# EAGLE board Main_Board_Rev_A1 (EAGLE 7.7.0)
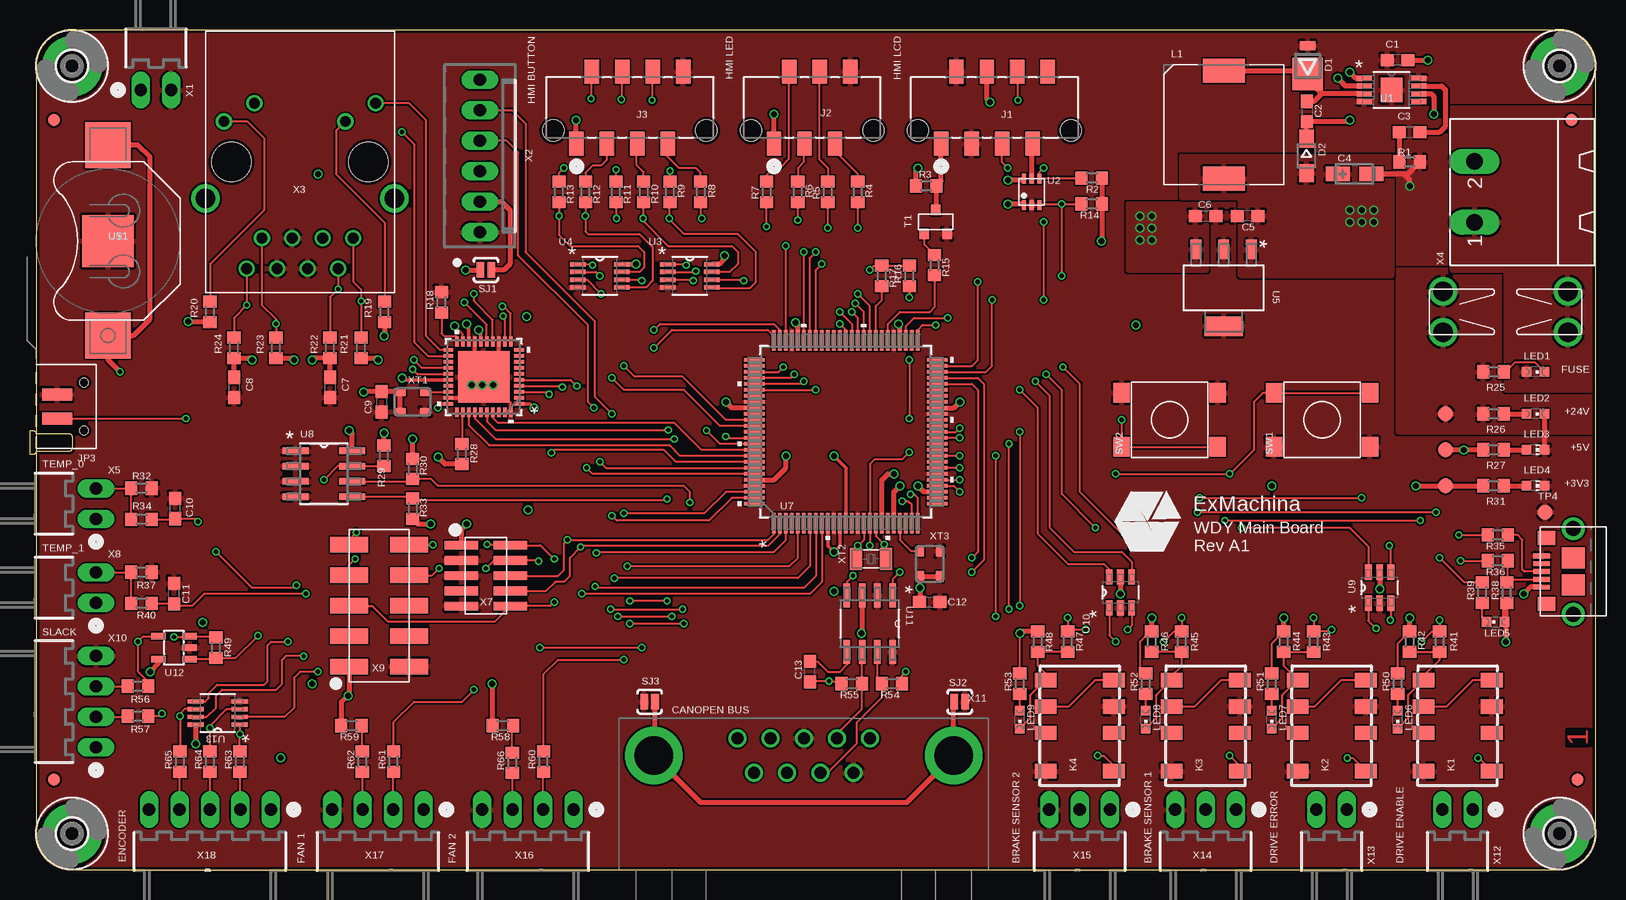
[diagram p5: board, top side]
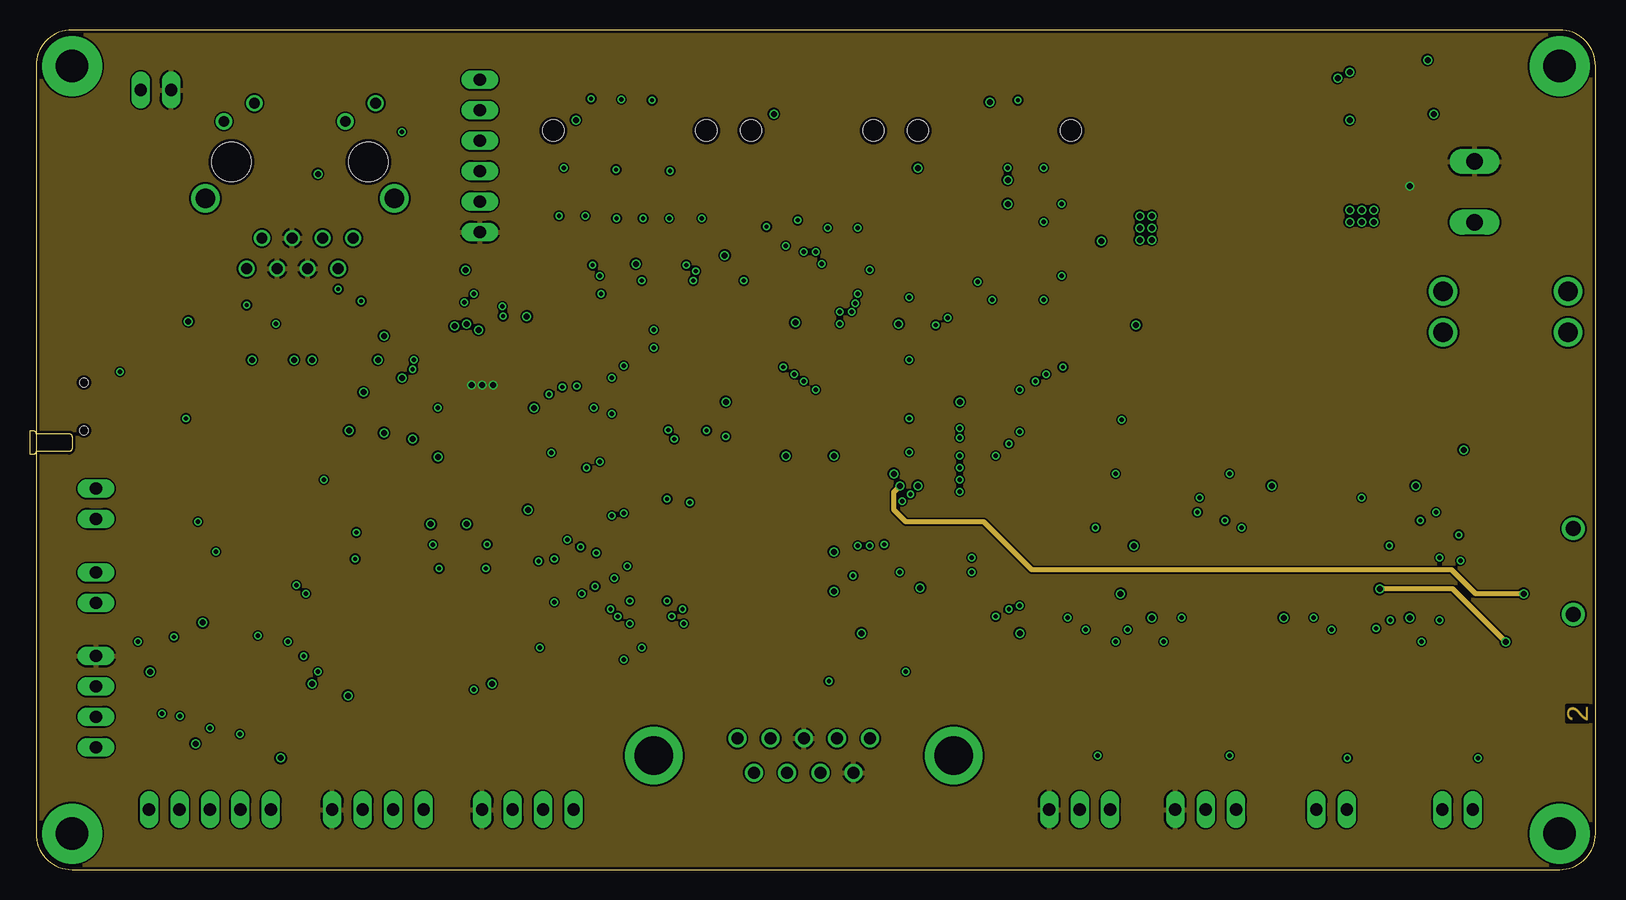
[diagram p6: board, inner layer Route2]
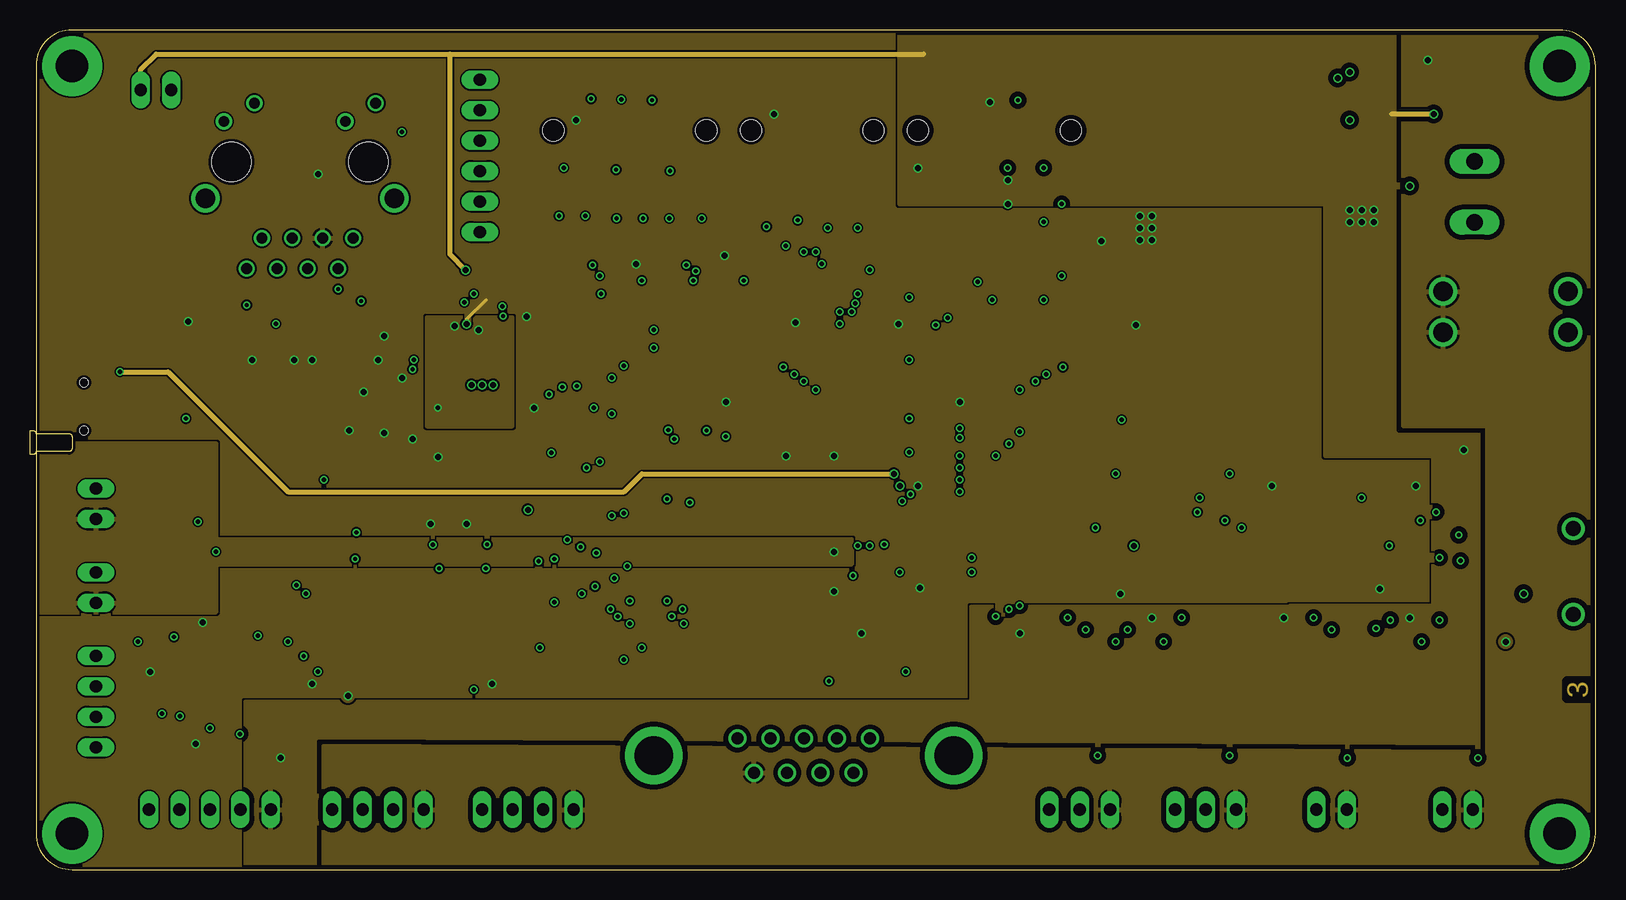
[diagram p7: board, inner layer Route15]
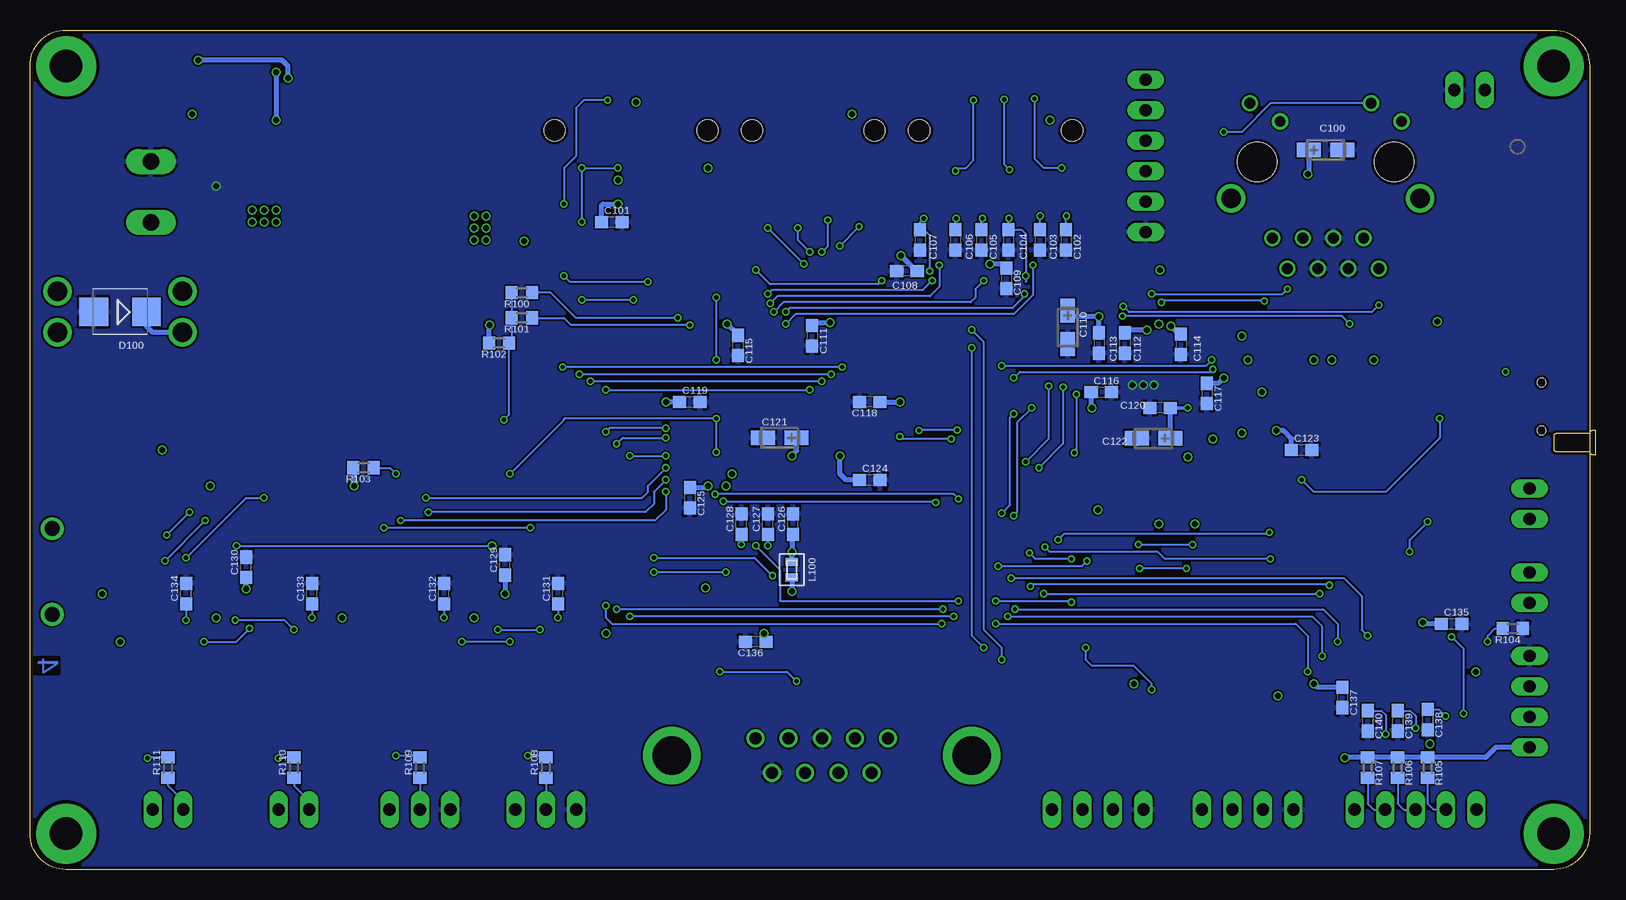
[diagram p8: board, bottom side, seen from below]

Size 130 x 70 mm. Coordinates in mm from the lower left corner, seen from the top.
Outline: 0,67 0,3 arc90 3,0 127,0 arc90 130,3 130,67 arc90 127,70 3,70 arc90 0,67
Copper layers (1+2*15+16): Top 0.018mm / dielectric 0.36mm / Route2 0.035mm / dielectric 0.71mm / Route15 0.035mm / dielectric 0.2mm / Bottom 0.018mm
Design rules "eC_4Layer_PClass6_BaseCopperO18-I35_eCDefault *": minimum track width 0.15mm, minimum drill 0.35mm, track to track 0.15mm, track to pad 0.15mm, pad to pad 0.15mm, via to via 0.15mm, smd to smd 0mil, copper to edge 0.25mm, drill to drill 0.35mm, minimum pad ring 0.175mm, minimum via ring 0.125mm, stop-mask expansion 0mil, vias tented up to drill 0.5mm, thermal gap 0.2mm
Net classes: 1 signal: width 0.178 mm, drill 0.35 mm; 2 supply: width 0.008 mm, drill 0.5 mm

## Footprints (pad centres in the part's own frame; a part is rotated, then mirrored left to right if it is on the bottom)
C0603 = smd 1.1 x 1: 1 -0.85,0; 2 0.85,0
CT3216 = smd 2 x 1.2: + -1.4,0; - 1.4,0
DO216AA = smd 0.76 x 1.27: A 0.7,0 | smd 2.67 x 2.574: C -1.665,0
SOD323-W = smd 1.5 x 1.2: A 1.45,0; C -1.45,0
SMB = smd 2.4 x 2.4: A 2.2,0; C -2.2,0
3557-LITTLE = drill 1.6: 1 -5.207,-1.702; 2 -5.207,1.702; 3 5.207,-1.702; 4 5.207,1.702
MOLEX_90814-0208 = smd 1.194 x 2.007: 1 -4.445,-3.175; 2 -3.175,2.819; 3 -1.905,-3.175; 4 -0.635,2.819; 5 0.635,-3.175; 6 1.905,2.819; 7 3.175,-3.175; 8 4.445,2.819 | hole 1.753: -6.375,-2.083; 6.375,-2.083
MOLEX_90814-0206 = smd 1.194 x 2.007: 1 -3.175,-3.175; 2 -1.905,2.819; 3 -0.635,-3.175; 4 0.635,2.819; 5 1.905,-3.175; 6 3.175,2.819 | hole 1.753: -5.105,-2.083; 5.105,-2.083
FIDUCIAL-1X2 = smd 1 x 1: 1 0,0
BC-2-P = smd 1 x 2.5: 1 -1,-0.75; 2 1,-0.75 | hole 0.7: -2,-3; 2,-3
G6K-2G-Y = smd 1.2 x 1.8: 1 -3.8,-2.85; 2 -0.6,-2.85; 3 1.6,-2.85; 4 3.8,-2.85; 5 3.8,2.85; 6 1.6,2.85; 7 -0.6,2.85; 8 -3.8,2.85
WE-PD_1030/1050 = smd 2 x 3.5: 1 -4.5,0; 2 4.5,0
0603 = smd 0.64 x 1.02: P$1 -0.64,0; P$2 0.64,0
CHIPLED_0603 = smd 0.8 x 0.8: A 0,-0.75; C 0,0.75
CHIP-LED0603 = smd 0.8 x 0.8: A 0,-0.75; C 0,0.75
P2.5 = drill 2.7 pad 5: 1 0,0
R0603 = smd 1 x 1.1: 1 -0.85,0; 2 0.85,0
SJ_2S-NO = smd 0.635 x 1.27: 1 -0.45,0; 2 0.45,0
B3FS = smd 1.4 x 1.6: 1 4,-2.25; 2 -4,-2.25; 3 4,2.25; 4 -4,2.25
SOT−23 = smd 0.787 x 0.889: 1 0.94,1.003; 2 -0.94,1.003; 3 0,-1.003
B1,27 = smd 1.27 x 1.27: TP 0,0
SOP65P490X110-9N = smd 1.245 x 0.432: 1 -2.261,0.965; 2 -2.261,0.33; 3 -2.261,-0.33; 4 -2.261,-0.965; 5 2.261,-0.965; 6 2.261,-0.33; 7 2.261,0.33; 8 2.261,0.965 | smd 1.829 x 2.057: 9 0,0
SC-70-DCK = smd 0.35 x 0.85: 1 -0.65,-1.1; 2 0,-1.1; 3 0.65,-1.1; 4 0.65,1.1; 5 0,1.1; 6 -0.65,1.1
SOP65P400X130-8N = smd 1.321 x 0.356: 1 -1.829,0.965; 2 -1.829,0.33; 3 -1.829,-0.33; 4 -1.829,-0.965; 5 1.829,-0.965; 6 1.829,-0.33; 7 1.829,0.33; 8 1.829,0.965
SOT230P700X180-4N = smd 1.626 x 0.889: 1 -3.2,2.311; 2 -3.2,0; 3 -3.2,-2.311 | smd 1.626 x 3.175: 4 3.2,0
SQA40B = smd 0.813 x 0.305: 1 -2.946,2.25; 2 -2.946,1.75; 3 -2.946,1.25; 4 -2.946,0.75; 5 -2.946,0.25; 6 -2.946,-0.25; 7 -2.946,-0.75; 8 -2.946,-1.25; 9 -2.946,-1.75; 10 -2.946,-2.25; 21 2.946,-2.25; 22 2.946,-1.75; 23 2.946,-1.25; 24 2.946,-0.75; 25 2.946,-0.25; 26 2.946,0.25; 27 2.946,0.75; 28 2.946,1.25; 29 2.946,1.75; 30 2.946,2.25 | smd 0.305 x 0.813: 11 -2.25,-2.946; 12 -1.75,-2.946; 13 -1.25,-2.946; 14 -0.75,-2.946; 15 -0.25,-2.946; 16 0.25,-2.946; 17 0.75,-2.946; 18 1.25,-2.946; 19 1.75,-2.946; 20 2.25,-2.946; 31 2.25,2.946; 32 1.75,2.946; 33 1.25,2.946; 34 0.75,2.946; 35 0.25,2.946; 36 -0.25,2.946; 37 -0.75,2.946; 38 -1.25,2.946; 39 -1.75,2.946; 40 -2.25,2.946 | smd 4.3 x 4.3: 41 0,0
SOT407-1 = smd 1.727 x 0.279: 1 -7.62,6; 2 -7.62,5.5; 3 -7.62,5; 4 -7.62,4.5; 5 -7.62,4; 6 -7.62,3.5; 7 -7.62,3; 8 -7.62,2.5; 9 -7.62,2; 10 -7.62,1.5; 11 -7.62,1; 12 -7.62,0.5; 13 -7.62,0; 14 -7.62,-0.5; 15 -7.62,-1; 16 -7.62,-1.5; 17 -7.62,-2; 18 -7.62,-2.5; 19 -7.62,-3; 20 -7.62,-3.5; 21 -7.62,-4; 22 -7.62,-4.5; 23 -7.62,-5; 24 -7.62,-5.5; 25 -7.62,-6; 51 7.62,-6; 52 7.62,-5.5; 53 7.62,-5; 54 7.62,-4.5; 55 7.62,-4; 56 7.62,-3.5; 57 7.62,-3; 58 7.62,-2.5; 59 7.62,-2; 60 7.62,-1.5; 61 7.62,-1; 62 7.62,-0.5; 63 7.62,0; 64 7.62,0.5; 65 7.62,1; 66 7.62,1.5; 67 7.62,2; 68 7.62,2.5; 69 7.62,3; 70 7.62,3.5; 71 7.62,4; 72 7.62,4.5; 73 7.62,5; 74 7.62,5.5; 75 7.62,6 | smd 0.279 x 1.727: 26 -6,-7.62; 27 -5.5,-7.62; 28 -5,-7.62; 29 -4.5,-7.62; 30 -4,-7.62; 31 -3.5,-7.62; 32 -3,-7.62; 33 -2.5,-7.62; 34 -2,-7.62; 35 -1.5,-7.62; 36 -1,-7.62; 37 -0.5,-7.62; 38 0,-7.62; 39 0.5,-7.62; 40 1,-7.62; 41 1.5,-7.62; 42 2,-7.62; 43 2.5,-7.62; 44 3,-7.62; 45 3.5,-7.62; 46 4,-7.62; 47 4.5,-7.62; 48 5,-7.62; 49 5.5,-7.62; 50 6,-7.62; 76 6,7.62; 77 5.5,7.62; 78 5,7.62; 79 4.5,7.62; 80 4,7.62; 81 3.5,7.62; 82 3,7.62; 83 2.5,7.62; 84 2,7.62; 85 1.5,7.62; 86 1,7.62; 87 0.5,7.62; 88 0,7.62; 89 -0.5,7.62; 90 -1,7.62; 91 -1.5,7.62; 92 -2,7.62; 93 -2.5,7.62; 94 -3,7.62; 95 -3.5,7.62; 96 -4,7.62; 97 -4.5,7.62; 98 -5,7.62; 99 -5.5,7.62; 100 -6,7.62
SOIC127P600X175-8N = smd 2.184 x 0.559: 1 -2.362,1.905; 2 -2.362,0.635; 3 -2.362,-0.635; 4 -2.362,-1.905; 5 2.362,-1.905; 6 2.362,-0.635; 7 2.362,0.635; 8 2.362,1.905
SOT95P280X145-6N = smd 1.27 x 0.559: 1 -1.295,0.94; 2 -1.295,0; 3 -1.295,-0.94; 4 1.295,-0.94; 5 1.295,0; 6 1.295,0.94
SOIC127P600X175-8N' = smd 1.981 x 0.559: 1 -2.362,1.905; 2 -2.362,0.635; 3 -2.362,-0.635; 4 -2.362,-1.905; 5 2.362,-1.905; 6 2.362,-0.635; 7 2.362,0.635; 8 2.362,1.905
SOT23-DBV = smd 0.55 x 1.2: 1 -0.95,-1.3; 2 0,-1.3; 3 0.95,-1.3; 4 0.95,1.3; 5 -0.95,1.3
3000 = smd 3.81 x 3.81: +1 -7.874,0; +2 8.001,0 | smd 4.318 x 4.318: - 0,0
7395-02 = drill 1.016 long: 1 1.27,0; 2 -1.27,0
6410-06 = drill 1.016 long: 1 6.35,0; 2 3.81,0; 3 1.27,0; 4 -1.27,0; 5 -3.81,0; 6 -6.35,0
WIZNET_RB1-125BAG1A = drill 0.9: L1 6.325,-3.38; L2 3.784,-4.899; L3 -3.786,-3.379; L4 -6.325,-4.9 | drill 0.9 pad 1.3: R1 -4.446,6.349; R2 -3.176,8.889; R3 -1.906,6.349; R4 -0.636,8.889; R5 0.634,6.349; R6 1.904,8.889; R7 3.174,6.349; R8 4.444,8.889 | drill 1.6 pad 2.184: S1 -7.876,3.049; S2 7.874,3.049 | hole 3.3: 5.714,-0.001; -5.716,-0.001
MSTBA2 = drill 1.397 long: 1 -2.54,5.08; 2 2.54,5.08
USB_MICROB_SMT = smd 0.4 x 1.4: 1 -1.3,2.65; 2 -0.65,2.65; 3 0,2.65; 4 0.65,2.65; 5 1.3,2.65 | smd 1.15 x 1.45: 7 -2.7,2.23; 8 2.8,2.23 | smd 1.75 x 1.9: 9 -1.125,0; 10 1.125,0 | drill 1.25 pad 1.9: 11 -3.575,0; 12 3.575,0
FTSH-105-01-L-DV = smd 0.737 x 2.794: 1 -2.54,-2.032; 2 -2.54,2.032; 3 -1.27,-2.032; 4 -1.27,2.032; 5 0,-2.032; 6 0,2.032; 7 1.27,-2.032; 8 1.27,2.032; 9 2.54,-2.032; 10 2.54,2.032
2.54/2X5 = smd 1.27 x 3.2: 1 -5.08,2.5; 2 -5.08,-2.5; 3 -2.54,2.5; 4 -2.54,-2.5; 5 0,2.5; 6 0,-2.5; 7 2.54,2.5; 8 2.54,-2.5; 9 5.08,2.5; 10 5.08,-2.5
7395-04 = drill 1.016 long: 1 3.81,0; 2 1.27,0; 3 -1.27,0; 4 -3.81,0
5504F1-09S-02A = drill 1: 1 -5.54,-1.42; 2 -2.77,-1.42; 3 0,-1.42; 4 2.77,-1.42; 5 5.54,-1.42; 6 -4.155,1.42; 7 -1.385,1.42; 8 1.385,1.42; 9 4.155,1.42 | drill 3.2: G1 -12.495,0; G2 12.495,0
7395-03 = drill 1.016 long: 1 2.54,0; 2 0,0; 3 -2.54,0
7395-05 = drill 1.016 long: 1 5.08,0; 2 2.54,0; 3 0,0; 4 -2.54,0; 5 -5.08,0
ASE = smd 0.9 x 0.65: 1 -1.05,-0.825; 2 1.05,-0.825; 3 1.05,0.825; 4 -1.05,0.825
FC-135 = smd 1 x 1.8: 1 -1.25,0; 2 1.25,0

## Placement (x,y rotation side)
C1  2.2uF  [C0603]  113.5,67.5 180 top
C2  0.1uF  [C0603]  105.95,63.2 270 top
C3  0.1uF  [C0603]  114.5,61.5 0 top
C4  10uF  [CT3216]  109.9,58 0 top
C5  1uF  [C0603]  101,54.5 180 top
C6  1uF  [C0603]  97.5,54.5 0 top
C7  100nF  [C0603]  24.5,40.2 270 top
C8  100nF  [C0603]  16.5,40.2 270 top
C9  100nF  [C0603]  28.8,39 270 top
C10  4.7uF  [C0603]  11.6,30.1 90 top
C11  4.7uF  [C0603]  11.5,23 90 top
C12  0.1uF  [C0603]  74.5,22.3 0 top
C13  4700pF  [C0603]  64.5,16.5 90 top
C100  4.7uF  [CT3216]  22,60 0 bottom
C101  0.1uF  [C0603]  81.5,54 0 bottom
C102  0.1uF  [C0603]  43.65,52.5 270 bottom
C103  0.1uF  [C0603]  45.8,52.5 270 bottom
C104  0.1uF  [C0603]  48.45,52.5 270 bottom
C105  0.1uF  [C0603]  50.7,52.5 270 bottom
C106  0.1uF  [C0603]  52.85,52.5 270 bottom
C107  0.1uF  [C0603]  55.8,52.5 270 bottom
C108  0.1uF  [C0603]  56.9,49.9 180 bottom
C109  0.1uF  [C0603]  48.6,49.3 270 bottom
C110  10uF  [CT3216]  43.5,45.2 270 bottom
C111  0.1uF  [C0603]  64.8,44.5 270 bottom
C112  100nF  [C0603]  38.75,43.9 270 bottom
C113  100nF  [C0603]  40.9,43.9 270 bottom
C114  100nF  [C0603]  34.05,43.8 270 bottom
C115  0.1uF  [C0603]  71,43.7 270 bottom
C116  100nF  [C0603]  40.7,39.8 0 bottom
C117  100nF  [C0603]  31.9,39.7 270 bottom
C118  0.1uF  [C0603]  60,39 180 bottom
C119  0.1uF  [C0603]  75,39 0 bottom
C120  100nF  [C0603]  35.8,38.5 180 bottom
C121  10uF  [CT3216]  67.5,36 180 bottom
C122  10uF  [CT3216]  36.35,35.95 180 bottom
C123  0.1uF  [C0603]  24,35 0 bottom
C124  0.1uF  [C0603]  60,32.5 0 bottom
C125  0.1uF  [C0603]  75,31 270 bottom
C126  0.1uF  [C0603]  66.4,28.8 90 bottom
C127  18pF  [C0603]  68.5,28.8 90 bottom
C128  18pF  [C0603]  70.7,28.8 90 bottom
C129  0.1uF  [C0603]  90.4,25.4 90 bottom
C130  0.1uF  [C0603]  112,25.2 90 bottom
C131  0.1uF  [C0603]  86,23 90 bottom
C132  0.1uF  [C0603]  95.5,23 90 bottom
C133  0.1uF  [C0603]  106.5,23 90 bottom
C134  0.1uF  [C0603]  117,23 90 bottom
C135  0.1uF  [C0603]  11.5,20.5 0 bottom
C136  100nF  [C0603]  69.5,19 180 bottom
C137  0.1uF  [C0603]  20.6,14.35 270 bottom
C138  0.1uF  [C0603]  13.5,12.5 270 bottom
C139  0.1uF  [C0603]  16,12.4 270 bottom
C140  0.1uF  [C0603]  18.5,12.4 270 bottom
D1  USB120  [DO216AA]  106,68 90 top
D2  CMDSH2-3  [SOD323-W]  105.9,59.5 270 top
D100  Green  [SMB]  122.5,46.5 180 bottom
F1  FUSE3557L  [3557-LITTLE]  122.5,46.5 180 top
J1  90814-0208  [MOLEX_90814-0208]  79.9,63.7 0 top
J2  90814-0206  [MOLEX_90814-0206]  64.7,63.7 0 top
J3  90814-0208  [MOLEX_90814-0208]  49.5,63.7 0 top
JP1  FIDUCIAL1X2  [FIDUCIAL-1X2]  128,62.5 0 top
JP2  FIDUCIAL1X2  [FIDUCIAL-1X2]  1.5,62.5 0 top
JP3  BC-2-P  [BC-2-P]  1,38.6 90 top
JP4  FIDUCIAL1X2  [FIDUCIAL-1X2]  128.5,7.5 0 top
JP5  FIDUCIAL1X2  [FIDUCIAL-1X2]  1.5,7.5 0 top
K1  G6K-2G-Y  [G6K-2G-Y]  118.5,12 90 top
K2  G6K-2G-Y  [G6K-2G-Y]  108,12 90 top
K3  G6K-2G-Y  [G6K-2G-Y]  97.5,12 90 top
K4  G6K-2G-Y  [G6K-2G-Y]  87,12 90 top
L1  4.7uF  [WE-PD_1030/1050]  99,62.1 270 top
L100  0603PS-103KLB  [0603]  66.5,25 90 bottom
LED1  Red  [CHIPLED_0603]  125,41.5 270 top
LED2  Blue  [CHIPLED_0603]  125,38 270 top
LED3  Blue  [CHIP-LED0603]  125,35 270 top
LED4  Blue  [CHIP-LED0603]  125,32 270 top
LED5  [CHIPLED_0603]  121.65,20.65 90 top
LED6  Blue  [CHIPLED_0603]  113.5,12.5 180 top
LED7  Blue  [CHIPLED_0603]  103,12.5 180 top
LED8  Blue  [CHIPLED_0603]  92.5,12.5 180 top
LED9  Blue  [CHIPLED_0603]  82,12.5 180 top
MP1  MOUNT-PAD2.5  [P2.5]  127,67 0 top
MP2  MOUNT-PAD2.5  [P2.5]  3,67 0 top
MP3  MOUNT-PAD2.5  [P2.5]  127,3 0 top
MP4  MOUNT-PAD2.5  [P2.5]  3,3 0 top
R1  4K7  [R0603]  114.5,59 180 top
R2  4K7  [R0603]  88,57.65 180 top
R3  33  [R0603]  74.2,57 0 top
R4  100  [R0603]  68.5,56.5 270 top
R5  100  [R0603]  66,56.5 90 top
R6  100  [R0603]  63.5,56.5 270 top
R7  100  [R0603]  60.9,56.5 90 top
R8  1K  [R0603]  55.4,56.5 270 top
R9  1K  [R0603]  52.85,56.5 270 top
R10  1K  [R0603]  50.65,56.5 270 top
R11  1K  [R0603]  48.35,56.5 270 top
R12  1K  [R0603]  45.8,56.5 270 top
R13  1K  [R0603]  43.6,56.5 270 top
R14  4K7  [R0603]  88,55.5 180 top
R15  100  [R0603]  74.9,50.4 270 top
R16  0R  [R0603]  72.8,49.5 90 top
R17  0R  [R0603]  70.5,49.5 270 top
R18  4K7  [R0603]  33.8,47.3 90 top
R19  220  [R0603]  29.05,46.5 270 top
R20  220  [R0603]  14.5,46.5 270 top
R21  49.9  [R0603]  27.1,43.5 90 top
R22  49.9  [R0603]  24.5,43.5 90 top
R23  49.9  [R0603]  20,43.5 90 top
R24  49.9  [R0603]  16.5,43.5 90 top
R25  4K7  [R0603]  121.5,41.5 180 top
R26  4K7  [R0603]  121.5,38 180 top
R27  1K5  [R0603]  121.5,35 180 top
R28  4K7  [R0603]  35.5,34.65 90 top
R29  4K7  [R0603]  29,34.5 90 top
R30  4K7  [R0603]  31.4,33.4 90 top
R31  1K5  [R0603]  121.5,32 180 top
R32  10K  [R0603]  8.8,31.8 0 top
R33  4K7  [R0603]  31.4,30.1 270 top
R34  10K  [R0603]  8.8,29.2 0 top
R35  33  [R0603]  121.85,27.9 180 top
R36  33  [R0603]  121.85,25.75 180 top
R37  10K  [R0603]  8.8,24.8 180 top
R38  1K5  [R0603]  122.6,23.1 90 top
R39  1K5  [R0603]  120.55,23.1 90 top
R40  10K  [R0603]  8.8,22.2 180 top
R41  100  [R0603]  117,19 90 top
R42  4K7  [R0603]  114.5,19 270 top
R43  100  [R0603]  106.5,19 90 top
R44  4K7  [R0603]  104,19 270 top
R45  100  [R0603]  95.5,19 90 top
R46  4k7  [R0603]  93,19 270 top
R47  100  [R0603]  86,19 90 top
R48  4k7  [R0603]  83.5,19 270 top
R49  1K2  [R0603]  15,18.5 90 top
R50  1K5  [R0603]  113.5,15.5 90 top
R51  1K5  [R0603]  103,15.5 90 top
R52  1K5  [R0603]  92.5,15.5 90 top
R53  1K5  [R0603]  82,15.5 90 top
R54  60.4  [R0603]  71.35,15.5 180 top
R55  60.4  [R0603]  68,15.5 180 top
R56  1K8  [R0603]  8.5,15.3 0 top
R57  1K8  [R0603]  8.5,12.8 0 top
R58  10K  [R0603]  38.9,12 180 top
R59  10K  [R0603]  26.3,12 180 top
R60  1K  [R0603]  42.3,9 90 top
R61  1K  [R0603]  29.8,9 90 top
R62  100  [R0603]  27.2,9 90 top
R63  100  [R0603]  17,9 90 top
R64  100  [R0603]  14.5,9 90 top
R65  100  [R0603]  12,9 90 top
R66  100  [R0603]  39.7,8.9 90 top
R100  0R  [R0603]  89,48.1 180 bottom
R101  0R  [R0603]  89,46 180 bottom
R102  10K  [R0603]  90.9,43.9 180 bottom
R103  10K  [R0603]  102.2,33.5 180 bottom
R104  1K2  [R0603]  6.4,20.1 180 bottom
R105  4K7  [R0603]  13.5,8.5 270 bottom
R106  4K7  [R0603]  16,8.5 270 bottom
R107  4K7  [R0603]  18.5,8.5 270 bottom
R108  100  [R0603]  87,8.5 90 bottom
R109  100  [R0603]  97.5,8.5 90 bottom
R110  100  [R0603]  108,8.5 90 bottom
R111  100  [R0603]  118.5,8.5 90 bottom
SJ1  SOLDERJUMPERNO  [SJ_2S-NO]  37.5,50 180 top
SJ2  SOLDERJUMPERNO  [SJ_2S-NO]  77,14 0 top
SJ3  SOLDERJUMPERNO  [SJ_2S-NO]  51.15,14 180 top
SW1  B3FS-1015  [B3FS]  107.2,37.5 0 top
SW2  B3FS-1015  [B3FS]  94.5,37.5 180 top
T1  MMBT2222AL  [SOT−23]  75,54 180 top
TP1  TPB1,27  [B1,27]  117.5,38 90 top
TP2  TPB1,27  [B1,27]  117.5,35 90 top
TP3  TPB1,27  [B1,27]  117.5,32 90 top
TP4  TPB1,27  [B1,27]  125.8,29.8 0 top
U1  LT1767EMS8E-5PBF  [SOP65P490X110-9N]  113,65 0 top
U2  TPL0401A  [SC-70-DCK]  83,56.5 0 top
U3  SN74LVC3G17DCTR  [SOP65P400X130-8N]  54.5,49.5 0 top
U4  SN74LVC3G17DCTR  [SOP65P400X130-8N]  47,49.5 0 top
U5  TC1264-3.3  [SOT230P700X180-4N]  99,48.5 270 top
U6  DP83848JSQ/NOPB  [SQA40B]  37.32,41.07 180 top
U7  LPC1768FBD100  [SOT407-1]  67.5,36.5 90 top
U8  AT24C512C-SSHM-B  [SOIC127P600X175-8N]  24,33 0 top
U9  SN74LVC2G17DBVR  [SOT95P280X145-6N]  112,23.5 90 top
U10  SN74LVC2G17DBVR  [SOT95P280X145-6N]  90.4,23.1 90 top
U11  MCP2561-E/SN  [SOIC127P600X175-8N']  69.5,20.5 270 top
U12  TLV313  [SOT23-DBV]  11.5,18.5 90 top
U13  SN74LVC3G17DCTR  [SOP65P400X130-8N]  15.15,13.05 180 top
U$1  3000  [3000]  6,52.4 90 top
U$2  EXMACHINA-LOGO-NAME  [EXM-LOGO-BASELINE]  92.61,28.99 0 top
X1  22-05-7028-02  [7395-02]  10,65 180 top
X2  22-27-2061-06  [6410-06]  37,59.5 270 top
X3  RB1-125BAG1A  [WIZNET_RB1-125BAG1A]  22,59 180 top
X4  MSTBA2  [MSTBA2]  125,56.5 90 top
X5  22-05-7028-02  [7395-02]  5,30.5 270 top
X6  USB3075-30-A  [USB_MICROB_SMT]  128.15,24.85 90 top
X7  FTSH-105-01-L-DV  [FTSH-105-01-L-DV]  37.5,24.5 270 top
X8  22-05-7028-02  [7395-02]  5,23.5 270 top
X9  1241050-5  [2.54/2X5]  28.6,22 90 top
X10  22-05-7048-04  [7395-04]  5,14 270 top
X11  5504F1-09S-02A-03  [5504F1-09S-02A]  64,9.5 180 top
X12  22-05-7028-02  [7395-02]  118.5,5 0 top
X13  22-05-7028-02  [7395-02]  108,5 0 top
X14  22-05-7038-03  [7395-03]  97.5,5 0 top
X15  22-05-7038-03  [7395-03]  87,5 0 top
X16  22-05-7048-04  [7395-04]  41,5 0 top
X17  22-05-7048-04  [7395-04]  28.5,5 0 top
X18  22-05-7058-05  [7395-05]  14.5,5 0 top
XT1  ASE_50  [ASE]  31.4,39 0 top
XT2  FC-135  [FC-135]  69.6,25.9 0 top
XT3  ASE-12  [ASE]  74.5,25.5 90 top

## Tracks (layer width: path | path; a pad name or v marks a point on that pad's centre or on a via)
+3V3  (via drill 0.5)
  Top 0.305: U6.1 41.18,38.82 v41.5,38.5 | U7.13 67.5,33.5 v66.5,34.5 | U6.26 30.68,40.82 v30.5,41 | U6.18 36.07,45.33 v35.9,45.5
  Top 0.406: U13.8 13.32,10.52 v13.3,10.5 | R58.2 38.05,15.45 v38,15.5 | U3.8 56.36,50.5 57,50.5 57.4,50.9 v57.4,51.2 | U4.8 48.86,50.5 v50,50.5 | R2.1 R14.1 88.85,52.45 v88.8,52.4 | R19.2 29.05,44.55 v29,44.5 | v18,42.5 17.85,42.65 R24.1 C8.1 | R23.1 21.35,42.65 v21.5,42.5 | v23,42.5 23.15,42.65 R22.1 C7.1 | R21.1 28.35,42.65 v28.5,42.5 | v27.3,39.8 27.35,39.85 C9.1 30.32,39.85 XT1.4 XT1.1 | U11.3 68.86,19.77 v68.8,19.7 | U10.5 v90.4,23 | U9.5 v112,23.4 | 73.7,24.43 v73.7,23.5 73.7,22.35 C12.1 | 73.7,24.43 XT3.4 | R20.2 12.75,45.65 v12.7,45.7 | R30.2 v31.4,35.9 | R29.2 v29,36.4 | U8.8 26.36,36.34 v26.1,36.6 | R33.2 31.85,28.8 v32.9,28.8 | U7.84 58,38.5 v57.5,39 | U7.71 63.5,45.4 v63.3,45.6 | U7.54 72,45.4 v71.9,45.5 | U7.42 76.5,38.5 v77,39 | U7.28 74,31.5 v73.5,32 | U7.96 61.5,32.5 62.5,33.5 v62.5,34.5 | LED5.A 122.4,22.05 R38.1 122.5,22.15 v122.5,19 | v115,32 TP3.TP R31.2 | R28.1 34.1,33.8 v33.5,34.4 | 73.7,24.43 75.3,24.43 XT3.1 | R59.2 25.45,13.95 v26,14.5 26.1,14.6 X9.1 | J3.1 45,60.58 v45,62.5 | J2.1 61.5,60.55 v61.5,63 | U12.5 10.2,17.2 v9.5,16.5 | X7.1 35.47,28.37 v35.9,28.8
  Route2 0.406: v122.5,19 118.1,23.4 v112,23.4
  Route15 0.305: v35.9,45.5 35.9,45.9 37.5,47.5
  Bottom 0.406: C137.1 22.7,15.2 v23,15.5 | 57.35,51.2 v57.4,51.2 56.1,49.9 C108.1 | C109.1 48.95,50.5 v50,50.5 | C100.+ 23.4,58.1 v23.5,58 | v68.8,19.7 68.8,19.15 C136.1 | v112,23.4 C130.1 | C129.1 v90.4,23 | R102.2 91.75,45.35 v91.7,45.4 | R103.2 103,33.45 v103,32 | C123.1 24.85,35.95 25.5,36.6 v26.1,36.6 | C124.1 62,32.5 62.5,33 v62.5,34.5 | C125.1 73.65,31.85 v73.5,32 | C115.1 71,44.6 v71.9,45.5 | C111.1 64.55,45.6 v63.3,45.6 | C119.1 v77,39 | C118.1 v57.5,39 | v66.5,34.5 66.1,34.9 C121.+ | C116.1 41.55,38.55 v41.5,38.5 | C117.1 30.95,40.55 v30.5,41 | C113.1 v40.9,46.1 43,46.1 C110.+ | L100.P$1 v66.5,23.2 | C135.1 13.8,20.5 v13.9,20.6
  other vias: 92,54.5 92,53.5 92,52.5 93,52.5 93,53.5 93,54.5
  pour Route15 (rank 6): -11,73.5 135.5,73.5 135.5,-4 -11,-4
  pour Top (rank 3): 97.6,55.5 91,55.5 91,50 97.6,50
+5V  (via drill 0.5)
  Top 0.15: R53.2 v82,19.7 | R46.1 92.85,19.85 92,19 92,16.85 R52.2 | R51.2 103,18.85 R44.1 | R50.2 113.5,18.85 R42.1
  Top 0.406: R27.2 v119,35 TP2.TP | R44.1 v104,21 | R42.1 v114.5,21 | R46.1 v93,21 | U2.6 82.25,57.5 v81,57.5 | U2.1 82.25,55.5 v81,55.5 | R3.1 73.35,58.35 v73.5,58.5 | R48.1 82.15,19.85 v82,19.7 | U1.6 116.33,64.67 116.5,64.5 v116.5,63 | v79.5,64 79.27,64.23 J1.4 | v35.8,50 SJ1.2
  Route15 0.406: v116.5,63 113,63 | X1.1 8.73,66.73 10,68 34.5,68 | 34.5,68 74,68 | v35.8,50 34.5,51.3 34.5,68
  Bottom 0.406: v20.4,9.3 20.35,9.35 R107.1 R106.1 R105.1 8.65,9.35 7.81,10.19 X10.1 | C101.1 U2.1 82.25,55.5 v81,55.5
  other vias: 109.5,55 110.5,55 109.5,54 110.5,54 111.5,54 111.5,55
  pour Route15 (isolate 0.406, rank 2): 72,70.5 137.5,70.5 137.5,-8.5 17.5,-8 17.5,14 78,14 78,21.9 104.5,21.9 104.6,22 116.5,22 116.5,34.5 107.5,34.5 107.5,55.5 72,55.5
  pour Top (rank 2): 95.5,59.5 113,59.5 113,49.5 100.4,49.5 100.4,56 95.5,56
+24V  (via drill 0.5)
  Top 0.406: C1.1 v116,67.5 | U1.2 109.17,65.33 v108.5,66
  Bottom 0.406: D100.C 120.3,45.3 119.8,44.8 F1.4 | v108.5,66 108.5,67 109,67.5 v116,67.5
  pour Route15 (isolate 0.406): 142,-1.5 24,-1 24,10.3 121,9.8 121,37 114,37 114,70.5 141.5,70.5
  pour Top (rank 3): 113.5,36.5 134,36.5 134,50 113.5,50
ADC_SLACK_DETECTION  (via drill 0.35)
  Top 0.178: U7.7 64.5,25.3 63.5,24.3 v48.2,24.3 | v18.5,19.5 16.65,17.65 R49.1 14.9,17.55 U12.1
  Bottom 0.178: v48.2,24.3 20.5,24.3 19,22.8 19,20 v18.5,19.5
ADC_TEMP_0  (via drill 0.35)
  Top 0.178: R40.1 11.45,22.2 C11.1 arc90 11.65,22 | U7.9 65.5,24 64.5,23 v45.5,23 | v22.5,23 14,23 13,22 11.65,22 | 11.65,22 11.5,22
  Bottom 0.178: v45.5,23 v22.5,23
ADC_TEMP_1  (via drill 0.35)
  Top 0.178: R34.2 11.55,29.2 C10.1 13.25,29.25 v13.5,29 | U7.8 65,24.5 64,23.5 46.7,23.5 v46.6,23.6 | v21.7,23.7 21.5,23.5 18,23.5 v15,26.5
  Bottom 0.178: v46.6,23.6 46.4,23.8 21.8,23.8 v21.7,23.7 | v15,26.5 15,27.5 v13.5,29
AVDD  (via drill 0.5)
  Top 0.305: U7.10 66,27 v66.5,26.5 67,27 U7.12
  Bottom 0.406: C126.1 66.5,28.05 v66.5,26.5 L100.P$2
  pour Route15: -1,35.5 -1,21.5 15,21.5 15,25.5 68,25.5 68,27.5 15,27.5 15,35.5
BOOT_SELECT_P2_10  (via drill 0.35)
  Top 0.178: U7.53 72.5,45.3 73.2,46 v76,46
  Bottom 0.178: v76,46 84.5,46 86.6,48.1 R100.1
BOOT_SELECT_P2_12  (via drill 0.35)
  Top 0.178: U7.51 73.5,45 73.9,45.4 v75,45.4
  Bottom 0.178: v75,45.4 84.9,45.4 85.5,46 R101.1
BRAKE_SENSOR_1  (via drill 0.35)
  Top 0.178: U7.81 v65,40 | v82,40 83.5,38.5 83.5,28 86,25.5 89,25.5 89.5,25 89.5,24.43 U10.6
  Bottom 0.178: v82,40 v65,40
BRAKE_SENSOR_2  (via drill 0.35)
  Top 0.178: v64,40.7 63.8,40.5 U7.80 59.5,40.5 | v83.3,40.7 84.5,39.5 84.5,28.5 86.5,26.5 90.5,26.5 91.34,25.66 U10.4
  Bottom 0.178: v64,40.7 v83.3,40.7
CAN_H
  Top 0.178: X11.7 65.98,8.08 68.4,10.5 68.4,12.25 70.5,14.35 R54.2 70.14,15.87 U11.7
CAN_L
  Top 0.178: X11.2 66.77,11.32 68.85,13.4 R55.1 68.86,15.52 U11.6
CAN_RX  (via drill 0.35)
  Top 0.178: U7.46 78,40.5 78.5,40 78.5,26.5 v78,26 | v68.1,24.5 67.59,24 U11.4
  Bottom 0.178: v78,26 69.6,26 v68.1,24.5
CAN_SPLIT
  Top 0.178: U11.5 67.59,17.09 67,16.5 66,16.5 65.2,17.3 64.55,17.3 C13.2
CAN_TX  (via drill 0.35)
  Top 0.178: U7.47 78.5,41 79,40.5 79,25.8 v78,24.8 | v72,24.8 71.41,24.2 U11.1
  Bottom 0.178: v78,24.8 v72,24.8
DRIVE_EN  (via drill 0.35)
  Top 0.178: v100.5,28.5 109.5,28.5 111.06,26.94 U9.6 | v63.2,41.3 62.9,41 U7.79 | v84.2,41.3 85.5,40 85.5,31.3 v88.3,28.5
  Bottom 0.178: v88.3,28.5 v100.5,28.5 | v84.2,41.3 v63.2,41.3
DRIVE_ERR  (via drill 0.35, 0.5)
  Top 0.178: U7.78 61.9,41.5 v62.3,41.9 | v85.6,41.9 87,40.5 87,31.5 v91.5,27 | U9.4 112.94,26.86 v112.8,27
  Bottom 0.178: v112.8,27 v91.5,27 | v62.3,41.9 v85.6,41.9
EEPROM_SCL  (via drill 0.35)
  Top 0.178: U8.6 31.21,32.37 R30.1 32.95,32.55 33.5,32 54,32 54.5,31.5 v54.5,30.6 | U7.24 73,30.4 72.7,30.7 v72.2,30.7
  Bottom 0.178: v72.2,30.7 54.5,30.7 v54.5,30.6
EEPROM_SDA  (via drill 0.35)
  Top 0.178: U8.5 31.25,31.09 R33.1 31.55,30.8 52.5,30.8 v52.6,30.9 | U7.25 73.5,31 73.2,31.3 v72.9,31.3
  Bottom 0.178: v52.6,30.9 53,31.3 v72.9,31.3
ENCODER_A  (via drill 0.35)
  Top 0.178: U13.7 14.22,12.72 15,13.5 15,14.5 15.5,15 20,15 20.5,15.5 20.5,17.5 20.8,17.8 v22.3,17.8 | v48.5,21.1 v53,21.1 | v80,21.1 v80,34.5 | v77,34.5 U7.34
  Bottom 0.178: v53,21.1 v80,21.1 | v80,34.5 v77,34.5 | v48.5,21.1 23.1,21.1 22.3,20.3 v22.3,17.8
ENCODER_B  (via drill 0.35)
  Top 0.178: U13.5 14.12,14.02 14.4,14.3 14.4,14.7 15.1,15.4 19,15.4 19.3,15.7 19.3,18.7 19.6,19 v21,19 | v47.9,21.7 v53.9,21.7 | v81.1,21.7 v81.1,35.5 | v77,36 U7.37
  Bottom 0.178: v53.9,21.7 v81.1,21.7 | v81.1,35.5 80.6,36 v77,36 | v47.9,21.7 22.2,21.7 21,20.5 v21,19
ENCODER_Z  (via drill 0.35)
  Top 0.178: U7.38 76.7,36.5 v77,36.8 | v82,36.5 v82,22 | v54,20.5 v49.5,20.5 | v23.5,16.5 22,16.5 21.5,16 21.5,13.5 20.72,12.72 U13.2
  Bottom 0.178: v77,36.8 81.7,36.8 v82,36.5 | v54,20.5 81.5,20.5 82,21 v82,22 | v49.5,20.5 24.5,20.5 23.5,19.5 v23.5,16.5
ETH_CRS
  Top 0.178: U7.92 53.7,34.5 52.85,35.35 37.8,35.35 36.07,37.08 U6.33
ETH_MDC  (via drill 0.35)
  Top 0.178: U7.87 57,37 54,40 49,40 v48,41 | U6.25 31.78,41.32 v31.4,41.7
  Bottom 0.178: v48,41 47.5,41.5 31.6,41.5 v31.4,41.7
ETH_MDIO  (via drill 0.35)
  Top 0.178: U7.86 57.5,37.5 53.9,41.1 49.9,41.1 v49,42 | U6.24 32.18,41.82 v31.5,42.5
  Bottom 0.178: v31.5,42.5 32,42 v49,42
ETH_RX_ER  (via drill 0.35)
  Top 0.178: U6.34 36.57,37.63 38.3,35.9 v53.2,35.9 | v57.5,36.1 57.6,36 U7.89
  Bottom 0.178: v53.2,35.9 57.3,35.9 v57.5,36.1
ETH_RX_N  (via drill 0.35)
  Top 0.178: X3.R8 v17.56,47.06 16.5,46 R24.2 | U6.11 39.57,46.36 38.97,46.96 v38.87,46.96
  Bottom 0.178: v38.87,46.96 38.37,46.46 18.15,46.46 v17.56,47.06
ETH_RX_P  (via drill 0.35)
  Top 0.178: X3.R7 18.83,47.07 20,45.9 v20,45.5 R23.2 | v38.93,46.14 39.07,46 U6.12
  Bottom 0.178: v38.93,46.14 20.64,46.14 v20,45.5
ETH_RXD_N
  Top 0.178: U7.91 55.46,35 53.2,37.26 38.49,37.26 38.07,37.68 U6.37
ETH_RXD_P  (via drill 0.35)
  Top 0.178: U6.36 37.59,38.12 37.59,37.35 38.31,36.64 v52.7,36.64 | U7.90 57,35.5 v55.9,36.6
  Bottom 0.178: v55.9,36.6 55.86,36.64 v52.7,36.64
ETH_TX_N  (via drill 0.35)
  Top 0.178: X3.R2 v25.18,48.41 24.5,47.73 R22.2 | U6.14 38.07,45.83 36.5,47.4 v36.5,48
  Bottom 0.178: v36.5,48 25.58,48 v25.18,48.41
ETH_TX_P  (via drill 0.35)
  Top 0.178: X3.R1 26.45,49.01 27.1,48.36 v27.1,47.4 R21.2 | U6.15 37.57,45.43 v35.7,47.3
  Bottom 0.178: v35.7,47.3 35.5,47.5 27.2,47.5 v27.1,47.4
ETH_TXD_EN  (via drill 0.35)
  Top 0.178: U7.93 53.35,34 52.35,35 43.2,35 v42.95,34.75 | U6.3 42.58,39.82 v42.78,39.62
  Bottom 0.178: v42.78,39.62 42.78,34.92 v42.95,34.75
ETH_TXD_N  (via drill 0.35)
  Top 0.178: U7.95 46.4,33 v45.9,33.5 | U6.4 43.78,40.32 v43.88,40.22
  Bottom 0.178: v43.88,40.22 43.88,35.52 v45.9,33.5
ETH_TXD_P  (via drill 0.35)
  Top 0.178: U7.94 47.5,33.5 v47,34 | U6.5 44.58,40.82 v45.08,40.32
  Bottom 0.178: v45.08,40.32 45.08,35.92 v47,34
ETH_X1
  Top 0.178: U6.28 XT1.3
FAN_1_PWM  (via drill 0.35)
  Top 0.178: R61.2 29.8,12.3 31.5,14 35.5,14 v36.5,15 | U7.75 61.5,44.5 61,45 53,45 v51.5,43.5 | v50.5,18.5 v42,18.5
  Bottom 0.178: v50.5,18.5 51.5,19.5 v51.5,43.5 | v36.5,15 36.5,15.5 38,17 41.5,17 42,17.5 v42,18.5
FAN_1_SENSOR
  Top 0.178: R62.2 27.2,11.95 R59.1
FAN_2_PWM  (via drill 0.35)
  Top 0.178: U7.74 62,45 61.5,45.5 52,45.5 v51.5,45 | R60.2 42.3,16.3 43.5,17.5 v49,17.5
  Bottom 0.178: v49,17.5 49,18.5 50.5,20 50.5,44 v51.5,45
FAN_2_SENSOR
  Top 0.178: R66.2 39.7,11.95 R58.1
GND  (via drill 0.5)
  Top 0.15: 39.57,38.93 v38.1,40.4
  Top 0.178: U6.40 39.57,38.93 39,39.5
  Top 0.305: U6.13 38.57,43.07 38.5,43 | U6.17 36.57,43.07 36.5,43 | U6.29 36.3,39.32 v36.3,40.4
  Top 0.406: LED3.C LED2.C | R1.1 114.35,58 114,58 | 114,58 C4.- | v114.5,57 114.5,57.5 114,58 | 38.57,43.07 38.57,40.4 v38.1,40.4 | 36.57,43.07 36.57,43 36.5,43 36.5,40.4 v36.3,40.4
  other vias: 37.2,40.4
  pour Bottom (rank 6): -9.5,72.5 134.5,72.5 134.5,-2.5 -9.5,-2.5
  pour Top (rank 6): -13,75.5 138.5,75.5 138.5,-6.5 -13,-6.5
  pour Route2 (rank 6): -12,74.5 137,74.5 137,-5.5 -12,-5.5 -12,74
HMI_BUTTON_1  (via drill 0.35)
  Top 0.178: R13.1 43.6,58.1 v44,58.5 | v46.27,64.27 46.33,64.33 J3.2
  Bottom 0.178: v44,58.5 45.5,58.5 46.27,59.27 v46.27,64.27
HMI_BUTTON_2
  Top 0.178: R12.1 45.8,58.1 46.4,58.7 47.1,58.7 47.59,59.2 J3.3
HMI_BUTTON_3  (via drill 0.35)
  Top 0.178: R11.1 v48.35,58.35 | v48.8,64.2 48.87,64.27 J3.4
  Bottom 0.178: v48.35,58.35 48.81,58.81 v48.81,64.19 v48.8,64.2
HMI_BUTTON_4
  Top 0.178: R10.1 50.65,58.15 50.08,58.72 50.08,60.47 J3.5
HMI_BUTTON_5  (via drill 0.35)
  Top 0.178: R9.1 v52.85,58.25 | v51.35,64.15 51.41,64.2 J3.6
  Bottom 0.178: v52.85,58.25 52.6,58.5 52,58.5 51.35,59.15 v51.35,64.15
HMI_BUTTON_6
  Top 0.178: R8.1 55.4,58.1 55,58.5 53.6,58.5 52.62,59.48 52.62,60.47 J3.7
HMI_BUTTON_CPU_1  (via drill 0.35)
  Top 0.178: U4.1 46.34,50.47 v46.4,50.4 | v67,45.5 67.5,45 U7.63
  Bottom 0.178: v46.4,50.4 46.4,47.9 48,46.3 66.2,46.3 v67,45.5
HMI_BUTTON_CPU_2  (via drill 0.35)
  Top 0.178: U4.3 45.93,49.17 v47.1,48 | v67,46.5 68,45.5 U7.62
  Bottom 0.178: v47.1,48 47.1,47.8 48.1,46.8 66.7,46.8 v67,46.5
HMI_BUTTON_CPU_3  (via drill 0.35)
  Top 0.178: U7.61 68.5,46 v68,46.5 | U4.6 50.43,49.17 v50.5,49.1
  Bottom 0.178: v68,46.5 67.2,47.3 51.6,47.3 51.2,47.7 51.2,48.4 v50.5,49.1
HMI_BUTTON_CPU_4  (via drill 0.35)
  Top 0.178: U7.60 69,46.5 v68.3,47.2 | U3.1 54.13,50.47 v54.2,50.4
  Bottom 0.178: v54.2,50.4 54.2,48.6 55,47.8 67.7,47.8 v68.3,47.2
HMI_BUTTON_CPU_5  (via drill 0.35)
  Top 0.178: U7.59 69.5,47 v68.5,48 | U3.3 54.73,49.17 v54.8,49.1
  Bottom 0.178: v68.5,48 68.2,48.3 55.6,48.3 v54.8,49.1
HMI_BUTTON_CPU_6  (via drill 0.35)
  Top 0.178: U3.6 58.93,49.17 v59,49.1 | v69.5,50 69.85,50.35 R17.1 R16.2
  Bottom 0.178: v59,49.1 59.3,48.8 68.3,48.8 v69.5,50
HMI_BUTTON_MCU_FCT_6
  Top 0.178: U7.58 70,47 70.5,47.5 R17.2
HMI_LCD_BACKLIGHT
  Top 0.178: U7.56 71,45.5 72,46.5 74.5,46.5 74.9,46.9 R15.2
HMI_LCD_LED+
  Top 0.406: T1.3 75.05,55 R3.2 75.45,57.41 J1.1
HMI_LCD_SCL  (via drill 0.35)
  Top 0.178: U2.3 83.75,55.5 v85.5,55.5 | v85.5,55.5 R14.2 | U7.49 78,42 78.5,42.5 v78.5,49 | v85.5,49.5 v85.5,55.5 | v81.85,64.15 81.85,66.47 J1.6
  Bottom 0.178: v81.85,64.15 83.85,64.15 84.5,63.5 84.5,59.5 85.5,58.5 v85.5,55.5 | v78.5,49 85,49 v85.5,49.5
HMI_LCD_SDA  (via drill 0.35)
  Top 0.178: R2.2 83.7,57.65 U2.4 83.65,58.15 v84,58.5 | v81,58.5 80.53,58.97 J1.5 | U7.48 79.2,41.5 79.7,42 v79.7,47.5 | v84,47.5 v84,54
  Bottom 0.178: v81,58.5 v84,58.5 v84,54 | v79.7,47.5 v84,47.5
HMI_LCD_VO
  Top 0.406: U2.5 83,60.38 83.08,60.45 J1.7
HMI_LED_1  (via drill 0.35)
  Top 0.178: U7.73 v62.5,52 | v60.9,53.6 R7.1
  Bottom 0.178: v62.5,52 v60.9,53.6
HMI_LED_2  (via drill 0.35)
  Top 0.178: U7.70 v64,51.5 | v63.5,54.15 R6.2
  Bottom 0.178: v64,51.5 63.5,52 v63.5,54.15
HMI_LED_3  (via drill 0.35)
  Top 0.178: U7.69 64.5,51 v65,51.5 | v66,53.5 R5.1
  Bottom 0.178: v65,51.5 66,52.5 v66,53.5
HMI_LED_4  (via drill 0.35)
  Top 0.178: U7.68 65,50 v65.5,50.5 | v68.5,53.5 R4.2
  Bottom 0.178: v65.5,50.5 v68.5,53.5
ISP_RXDO  (via drill 0.35)
  Top 0.178: U7.99 58,31 56.1,29.1 48.4,29.1 v48,29.5 | v46.5,38.5 46,39 46,45.4 40.2,51.2 40.2,59.8 39.23,60.77 X2.4
  Bottom 0.178: v48,29.5 47.7,29.8 47.7,37.3 v46.5,38.5
ISP_TXDO  (via drill 0.35)
  Top 0.178: U7.98 57.5,31.5 55.7,29.7 v49,29.7 | X2.5 39.69,63.31 40.8,62.2 40.8,51.5 46.6,45.7 46.6,39.4 v48,38
  Bottom 0.178: v49,29.7 48.3,30.4 48.3,37.7 v48,38
JTAG_TCK  (via drill 0.35)
  Top 0.178: v49.3,25.3 62.8,25.3 63.5,26 U7.5 | X9.8 33.04,24.54 v33.6,25.1 | v37.5,25.1 38.17,25.77 X7.4 41.83,25.77 v41.9,25.7
  Bottom 0.178: v33.6,25.1 v37.5,25.1 | v49.3,25.3 42.3,25.3 v41.9,25.7
JTAG_TDI  (via drill 0.35)
  Top 0.178: U7.2 62,28 61,27 45.5,27 v45.4,26.9 44.5,26 44.5,24.5 44,24 43.3,24 42.53,23.23 X7.8 | X9.7 26.1,25.4 v26.6,25.9
  Bottom 0.178: v26.6,25.9 35.4,25.9 36,26.5 45,26.5 v45.4,26.9
JTAG_TDO  (via drill 0.35)
  Top 0.178: U7.1 61.5,28 61,27.5 v44.3,27.5 44,27.2 44,25 43.5,24.5 X7.6 | X9.9 26.1,27.5 v26.7,28.1
  Bottom 0.178: v26.7,28.1 26.8,28 43.8,28 v44.3,27.5
JTAG_TMS  (via drill 0.35)
  Top 0.178: v46.7,26.4 46.8,26.5 61.5,26.5 62.5,27.5 U7.3 | X9.10 v33.08,27.08 | v43.2,25.9 42.06,27.04 X7.2 39.47,27.1 v37.6,27.1
  Bottom 0.178: v43.2,25.9 46.2,25.9 v46.7,26.4 | v33.08,27.08 37.58,27.08 v37.6,27.1
L1_1  (via drill 0.35)
  Top 0.178: v30.5,61.5 31.5,60.5 31.5,44 32.68,42.82 U6.22
  Bottom 0.178: X3.L2 26.6,63.9 29,61.5 v30.5,61.5
L1_2
  Top 0.178: U6.21 33.68,43.32 32.5,44.5 32.5,62.5 31.1,63.9 X3.L4
MII_MODE
  Top 0.178: R28.2 35.57,35.57 U6.32
N$1
  Top 0.178: R6.1 63.5,58.5 64.04,59.04 64.04,60.5 J2.3
N$2
  Top 0.178: R4.1 68.5,58 66.58,59.92 66.58,60.5 J2.5
N$3  (via drill 0.35)
  Top 0.178: 67,15.65 R55.2 66.95,15.7 v66.1,15.7 64.55,15.7 C13.1 | R54.1 72.2,16.2 v72.5,16.5
  Bottom 0.178: v72.5,16.5 66.9,16.5 v66.1,15.7
N$4
  Top 0.178: R18.1 33.8,44.7 34,44.5 35,44.5 35.07,44.43 U6.20
N$5  (via drill 0.35)
  Top 0.178: SW2.4 SW2.3 v90.5,37.5
  Bottom 0.178: R100.2 R101.2 89.85,44.1 R102.1 90.05,37.95 v90.5,37.5
N$6
  Top 0.406: SJ2.1 76.5,13.95 X11.G1 72.59,5.6 55.41,5.6 X11.G2 51.6,9.6 SJ3.1
N$7
  Top 0.178: R15.1 74.06,52.09 T1.1
N$8
  Top 0.178: X3.L1 17.62,62.38 19,61 19,55 14.5,50.5 R20.1
N$9
  Top 0.178: X3.L3 25,61.59 25,58 29.05,53.95 R19.1
N$10  (via drill 0.5)
  other vias: 41,30
N$11
  Top 0.178: X17.2 29.77,8.12 R61.1
N$12
  Top 0.178: X16.3 39.73,8.02 R66.1
N$13
  Top 0.178: X16.2 42.27,8.12 R60.1
N$14
  Top 0.178: X17.3 27.23,8.12 R62.1
N$15
  Top 0.178: X6.2 122.85,24.2 R38.2 122.7,24.05 R36.1
N$16
  Top 0.178: X6.3 124.05,24.85 123.9,25 123.9,27.5 123.5,27.9 R35.1
N$17  (via drill 0.35)
  Top 0.178: R13.2 v43.6,54.5 43.6,52.9 44.5,52 50.2,52 50.7,51.5 50.7,50.2 50.33,49.83 U4.7
  Bottom 0.178: C102.1 43.65,54.45 v43.6,54.5
N$18
  Top 0.178: LED5.C 120.55,21 R39.1
N$19  (via drill 0.35)
  Top 0.178: U4.5 50.84,48.53 51.4,49.1 51.4,51.9 50.3,53 46,53 45.8,53.2 v45.8,54.5 R12.2
  Bottom 0.178: C103.1 v45.8,54.5
N$20  (via drill 0.35)
  Top 0.178: v48.4,54.3 48.4,55.6 R11.2 | U4.2 46.67,49.83 v47,49.5
  Bottom 0.178: v48.4,54.3 48.45,54.25 C104.1 47.35,53.35 47,53 v47,49.5 47,49
N$21
  Bottom 0.178: R109.1 X14.2
N$22  (via drill 0.35)
  Top 0.178: R29.1 26.38,33.65 U8.7 25.14,33.63 v24,32.5 | JP3.1 v12.5,37.6
  Bottom 0.178: v12.5,37.6 12.5,36 17,31.5 23,31.5 v24,32.5
N$23
  Bottom 0.178: R108.1 X15.2
N$24  (via drill 0.35)
  Top 0.178: v99.5,9.5 100.35,8.65 K3.1
  Bottom 0.178: v99.5,9.5 97.65,9.5 R109.2
N$25  (via drill 0.35)
  Top 0.178: U3.7 57.83,49.83 58.5,50.5 58.5,51.5 58,52 52.7,52 50.6,54.1 v50.6,54.3 50.6,55.6 R10.2
  Bottom 0.178: C105.1 50.7,54.2 v50.6,54.3
N$26  (via drill 0.35)
  Top 0.178: U3.5 56.36,48.5 59.5,48.5 60,49 60,51.5 58.5,53 54,53 52.8,54.2 v52.8,54.3 52.8,55.6 R9.2
  Bottom 0.178: C106.1 52.85,54.25 v52.8,54.3
N$27  (via drill 0.35)
  Top 0.178: R8.2 55.4,54.4 v55.5,54.3 | U3.2 54.93,49.83 v55,49.9
  Bottom 0.178: v55,49.9 55,52.85 55.5,53.35 C107.1 55.8,54 v55.5,54.3
N$28  (via drill 0.35)
  Top 0.178: v120.2,9.3 120.25,9.3 K1.1
  Bottom 0.178: R111.2 120.15,9.35 v120.2,9.3
N$29
  Top 0.178: K3.6 96.6,13.6 98.8,15.8 K3.4
N$31
  Top 0.178: X10.2 7.58,12.73 R57.1
N$32
  Bottom 0.178: X12.2 117.23,5.73 118.5,7 R111.1
N$33  (via drill 0.35)
  Top 0.178: v109.3,9.3 109.75,9.3 K2.1
  Bottom 0.178: R110.2 109.25,9.35 v109.3,9.3
N$35
  Top 0.178: X18.2 17.04,8.11 R63.1
  Bottom 0.178: R107.2 18.5,5.5 18,5 X18.2
N$37
  Bottom 0.178: X13.2 106.73,5.73 108,7 R110.1
N$38  (via drill 0.35)
  Top 0.178: v86,21 R47.2 86.15,20 v87.5,20 | U10.3 91.34,20.34 v91,20
  Bottom 0.178: C131.1 v86,21 | v91,20 v87.5,20
N$39  (via drill 0.35)
  Top 0.178: v95.5,21 R45.2 94.85,19.85 v94,19 | U10.1 89.46,19.54 v90,19
  Bottom 0.178: C132.1 v95.5,21 | v90,19 v94,19
N$40
  Top 0.178: X18.3 R64.1
  Bottom 0.178: R106.2 16,5.5 15.5,5 X18.3
N$41  (via drill 0.35)
  Top 0.15: 116.95,19.8 116.3,19.8 v115.5,19
  Top 0.178: v117,20.8 R41.2 116.95,19.8 | U9.1 111.06,20.74 v111.7,20.1
  Bottom 0.15: v115.5,19 112.8,19 v111.7,20.1
  Bottom 0.178: C134.1 v117,20.8 | v111.7,20.1 112,19.8
N$42  (via drill 0.35)
  Top 0.178: v106.5,21 R43.2 107.85,19.85 v108,20 | U9.3 112.94,20.84 v112.9,20.8
  Bottom 0.178: C133.1 v106.5,21 | v112.9,20.8 108.8,20.8 v108,20
N$43  (via drill 0.5)
  Top 0.406: D2.C 105.9,62.3 C2.2 109.35,62.35 v109.5,62.5 | U1.1 110.03,65.97 v109.5,66.5
  Bottom 0.406: v109.5,66.5 v109.5,62.5
N$44
  Top 0.406: R26.1 LED2.A
N$45
  Top 0.15: 122.5,41.5 123.3,42.3 124.95,42.3 LED1.C
  Top 0.406: R25.1 122.5,41.5
N$46
  Top 0.178: X18.4 11.96,8.11 R65.1
  Bottom 0.178: X18.4 13,5 13.5,5.5 R105.2
N$47
  Top 0.406: C3.1 R1.2
N$48
  Top 0.406: U1.7 117.17,65.33 117.5,65 117.5,62 117,61.5 C3.2
N$49
  Top 0.406: U1.3 107.17,64.67 | 107.17,64.67 106.55,64.05 C2.1 | 107.17,64.67 106,65.84 D1.C 105.73,66.6 L1.1
N$50
  Top 0.406: R31.1 LED4.A
N$51
  Top 0.406: R27.1 LED3.A
N$52  (via drill 0.35)
  Top 0.178: U13.6 12.38,13.38 12,13 v12,12.8 R65.2
  Bottom 0.178: C138.1 12.55,13.35 v12,12.8
N$53  (via drill 0.35)
  Top 0.178: U13.3 15.88,13.38 14.5,12 v14.5,11.8 R64.2
  Bottom 0.178: C139.1 14.95,13.25 14.5,12.8 v14.5,11.8
N$54  (via drill 0.35)
  Top 0.178: R63.2 16.98,9.87 16.98,11.28 v17,11.3 17,12.06 U13.1
  Bottom 0.178: C140.1 17.35,13.25 17,12.9 v17,11.3
N$55  (via drill 0.35)
  Top 0.178: v88.5,9.5 89,9.5 89.85,8.65 K4.1
  Bottom 0.178: v88.5,9.5 87.15,9.5 R108.2
N$57
  Top 0.178: K4.6 86.1,13.6 88.3,15.8 K4.4
N$58
  Top 0.15: LED8.C 93.4,12.65 93.4,14.55 K3.5
  Top 0.178: R45.1 R46.2 | R45.1 95.15,18.15 | K3.5 94.65,16.15 95.5,17 R45.1
N$59
  Top 0.178: K2.6 106.6,13.6 108.8,15.8 K2.4
N$60
  Top 0.178: K1.6 117.6,13.6 119.8,15.8 K1.4
N$61  (via drill 0.35)
  Top 0.178: R49.2 14.9,19.45 U12.3 12.75,19.4 v11.5,19.4 | R57.2 10.3,12.8 v10.5,13
  Bottom 0.178: v10.5,13 10.5,18.4 v11.5,19.4
N$63
  Top 0.178: R7.2 60.9,57.9 61.5,58.5 62,58.5 62.77,59.27 62.77,66.49 J2.2
N$64
  Top 0.178: R5.2 66,58.5 65.31,59.19 65.31,66.49 J2.4
N$65
  Top 0.178: X8.2 7.92,24.77 R37.2 R40.2
N$66
  Top 0.178: X5.2 7.92,31.77 R32.1 R34.1
N$67  (via drill 0.35)
  Top 0.178: R56.2 9.35,15.65 8.5,16.5 v8.5,19 8.95,19.45 U12.4
  Bottom 0.178: v8.5,19 8.5,19.5 7.9,20.1 R104.2
N$68
  Top 0.178: X10.3 7.62,15.27 R56.1
N$69
  Top 0.406: X2.2 38.81,55.69 39.5,55 39.5,50.5 39,50 SJ1.1
N$70
  Top 0.15: LED8.A R52.1
N$71
  Top 0.15: LED9.C 82.9,12.65 82.9,14.55 K4.5
  Top 0.178: R47.1 R48.2 83.5,17 84.15,16.35 K4.5
N$72
  Top 0.15: LED9.A R53.1
N$73
  Top 0.15: LED6.C 114.4,12.65 114.4,14.55 K1.5
  Top 0.178: R42.2 R41.1 117,17.5 115.65,16.15 K1.5
N$74
  Top 0.15: LED6.A R50.1
N$75
  Top 0.15: LED7.C 103.9,12.65 103.9,14.55 K2.5
  Top 0.178: R44.2 R43.1 | R44.2 103.65,17.8 | K2.5 105.15,15.85 104,17 R44.2
N$76
  Top 0.15: LED7.A R51.1
PFBOUT  (via drill 0.35, 0.5)
  Top 0.178: U6.19 35.57,44.63 v34.9,45.3
  Top 0.305: U6.30 33.82,38.82 v33.5,38.5 | U6.16 37.07,44.83 v36.9,45
  Bottom 0.305: C120.1 v33.5,38.5
  Bottom 0.406: C114.1 34.25,44.65 v34.9,45.3 | v36.9,45 38.5,45 C112.1 | C122.+ C120.1
  pour Route15: 39.7,37 39.7,46 32.6,46 32.6,37
RESET  (via drill 0.35)
  Top 0.178: R16.1 v72.8,47.7 | v72.8,42.5 v72.8,37.6 | v72.8,34.8 72.2,34.2 69.9,34.2 69.5,33.8 U7.17 v69.5,27 | SW1.4 SW1.3 | v90,33 v99.5,33 101.5,35 101.5,39 102.25,39.75 SW1.4 | 103.2,40.3 SW1.4 | X9.5 28,22 29.3,20.7 38.27,20.7 X7.10 42.86,21.96 v43.2,22.3 | v52.6,22.4 v49.5,22.4
  Bottom 0.178: v72.8,47.7 v72.8,42.5 | v72.8,34.8 v72.8,37.6 85.5,37.6 85.5,37.5 v90,33 | R103.1 100,33.5 v99.5,33 | v69.5,27 67.5,25 67.5,22.4 v52.6,22.4 | v49.5,22.4 43.3,22.4 v43.2,22.3
RTCX1  (via drill 0.35)
  Top 0.178: U7.16 69,27.5 v68.5,27 68.5,26.5 68.4,26.4 68.4,25.95 XT2.1
  Bottom 0.178: C127.1 v68.5,27
RTCX2  (via drill 0.35)
  Top 0.178: XT2.2 70.7,26.05 v70.7,27.1 70,27.8 U7.18
  Bottom 0.178: C128.1 v70.7,27.1
USB_D_N  (via drill 0.35)
  Top 0.178: U7.30 v77,32.5 | v96.8,29.8 v116.7,29.8 | v118.6,27.9 R35.2
  Bottom 0.178: v77,32.5 78,31.5 78,30.5 78.7,29.8 v96.8,29.8 | v116.7,29.8 v118.6,27.9
USB_D_P  (via drill 0.35)
  Top 0.178: U7.29 76.5,32 v77,31.5 | v99.1,29.1 v115.4,29.1 | v118.75,25.75 R36.2
  Bottom 0.178: v77,31.5 77,30 77.9,29.1 v99.1,29.1 | v115.4,29.1 v118.75,25.75
USB_UP_LED  (via drill 0.35)
  Top 0.178: R39.2 119.05,23.95 v117,26 | v77,33.5 U7.32 | v97,31 v110.5,31
  Bottom 0.178: v117,26 112,31 v110.5,31 | v97,31 79,31 78.5,31.5 78.5,32 v77,33.5
USB_V_BUS  (via drill 0.5)
  Top 0.406: X6.1 124.55,23.55 v124,23 | U7.21 71.5,31.5 v72,32
  Route2 0.406: v124,23 120,23 118,25 83,25 79,29 72.5,29 71.5,30 71.5,31.5 v72,32
VBAT+  (via drill 0.35, 0.5)
  Top 0.406: U7.19 70.5,32.5 71,33 v71.5,33 | v7,41.5 6,42.5 U$1.+1 8.13,44.53 9.5,45.9 9.5,59.4 8.5,60.4 U$1.+2
  Route15 0.406: v7,41.5 11,41.5 21,31.5 49,31.5 50.5,33 v71.5,33
VIN
  pour Top: 122.5,40 133,40 133,63.5 118,63.5 118,50 122.5,50
XTAL1
  Top 0.178: U7.22 72,27.5 72.95,26.55 XT3.3

## Text on the board
Top: 1
Route2: 2
Route15: 3
Bottom: 4
tPlace: HMI BUTTON | HMI LED | HMI LCD | FUSE | +24V | +5V | TEMP_0 | +3V3 | TEMP_1 | WDY Main Board / Rev A1 | SLACK | CANOPEN BUS | ENCODER | FAN 1 | FAN 2 | BRAKE SENSOR 2 | BRAKE SENSOR 1 | DRIVE ERROR | DRIVE ENABLE